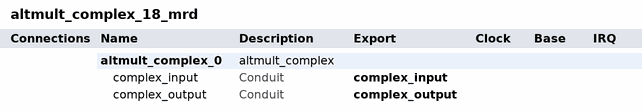
[diagram p0: system contents]
# Platform Designer (Qsys) system altmult_complex_18_mrd, Arria 10 10AX115U3F45E2SGE3
# Parameters at their usual value, and those the tool derives, are not listed.
package require qsys
create_system altmult_complex_18_mrd
set_project_property DEVICE_FAMILY {Arria 10}
set_project_property DEVICE 10AX115U3F45E2SGE3

add_instance altmult_complex_0 altmult_complex 15.1
set_instance_property altmult_complex_0 AUTO_EXPORT true
set_instance_parameter_value altmult_complex_0 CBX_AUTO_BLACKBOX ALL
set_instance_parameter_value altmult_complex_0 GUI_DYNAMIC_COMPLEX false
set_instance_parameter_value altmult_complex_0 GUI_USE_ACLR false
set_instance_parameter_value altmult_complex_0 GUI_USE_CLKEN false
set_instance_parameter_value altmult_complex_0 IMPLEMENTATION_STYLE AUTO
set_instance_parameter_value altmult_complex_0 PIPELINE 2
set_instance_parameter_value altmult_complex_0 REPRESENTATION_A 1
set_instance_parameter_value altmult_complex_0 REPRESENTATION_B 1
set_instance_parameter_value altmult_complex_0 WIDTH_A 18
set_instance_parameter_value altmult_complex_0 WIDTH_B 16
set_instance_parameter_value altmult_complex_0 WIDTH_RESULT 34

# exported interfaces
add_interface complex_input conduit end
set_interface_property complex_input EXPORT_OF altmult_complex_0.complex_input
add_interface complex_output conduit end
set_interface_property complex_output EXPORT_OF altmult_complex_0.complex_output

set_interconnect_requirement {$system} qsys_mm.clockCrossingAdapter HANDSHAKE
set_interconnect_requirement {$system} qsys_mm.enableEccProtection FALSE
set_interconnect_requirement {$system} qsys_mm.insertDefaultSlave FALSE
set_interconnect_requirement {$system} qsys_mm.maxAdditionalLatency 1

save_system altmult_complex_18_mrd.qsys
